# EAGLE design VEML6040 (EAGLE 7.4.0)
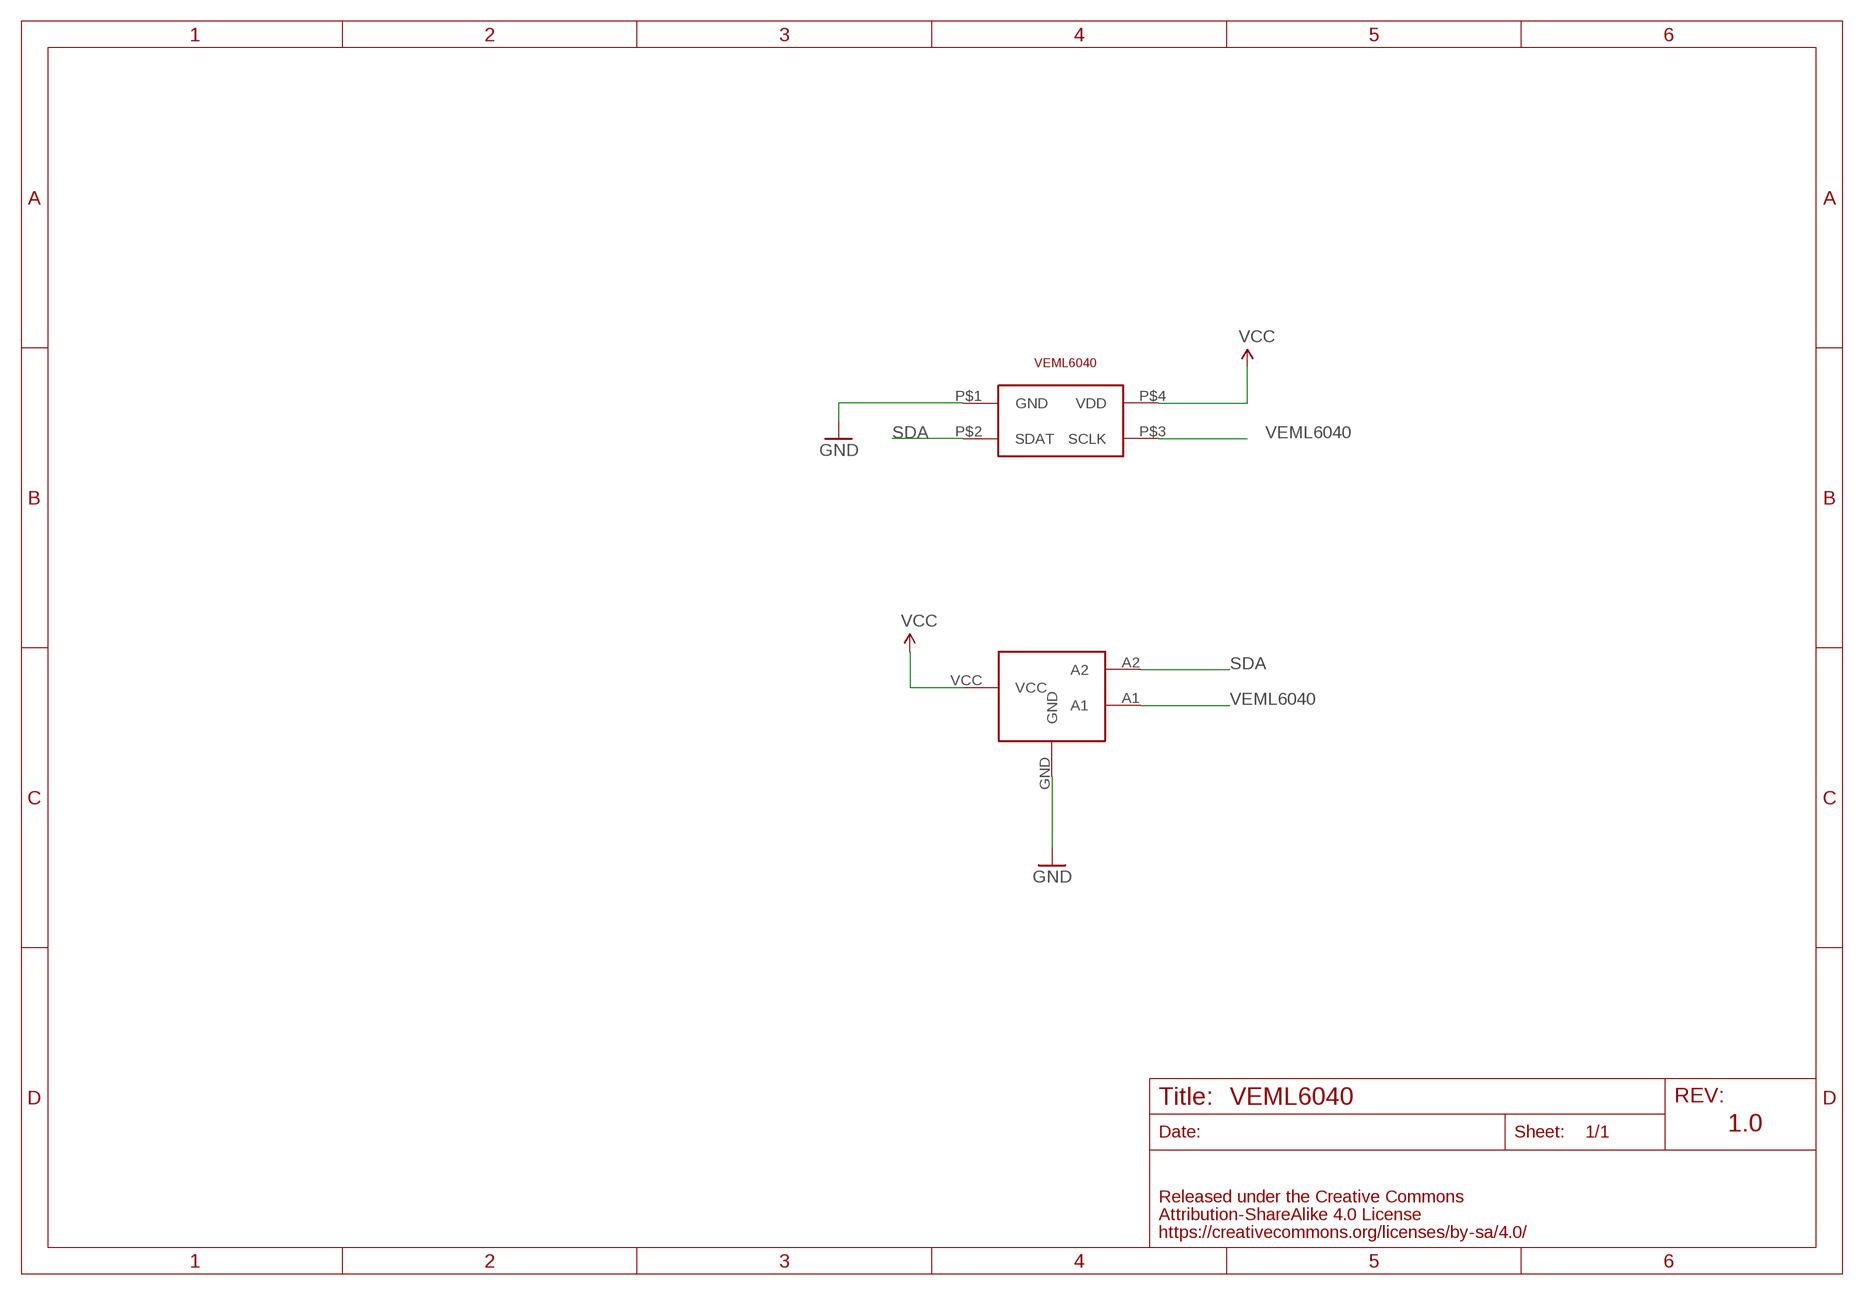
[diagram p0: schematic, sheet 1]

## Parts
6040  VI-VEML6040  [VISHAY-VEML6040]
U$5  4PIN  [4PIN]

## Nets
GND: 6040.P$1(GND) U$5.GND
SDA: 6040.P$2(SDAT) U$5.A2
VCC: 6040.P$4(VDD) U$5.VCC
VEML6040: 6040.P$3(SCLK) U$5.A1

## Notes on the sheet
- 1.0

## Library data of the parts
6040 = FaBo-Mems:VI-VEML6040
U$5 = FaBo-Breakout:4PIN

## Board
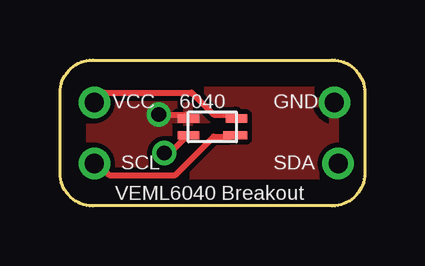
[diagram p1: board, top side]
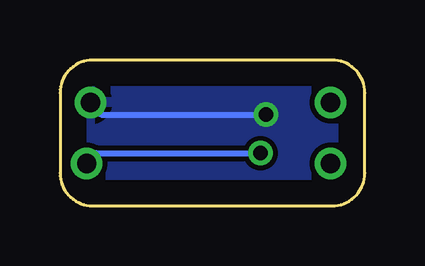
[diagram p2: board, bottom side, seen from below]

Size 12.7 x 6.08 mm. Coordinates in mm from the lower left corner, seen from the top.
Copper layers (1*16): Top 0.035mm / dielectric 1.5mm / Bottom 0.035mm
Design rules "default": minimum track width 10mil, minimum drill 24mil, track to track 8mil, track to pad 8mil, pad to pad 8mil, via to via 8mil, smd to smd 8mil, copper to edge 40mil, drill to drill 8mil, minimum pad ring 10mil, minimum via ring 8mil, stop-mask expansion 4mil, vias tented up to drill 0mil, thermal gap 10mil

### Footprints (pad centres in the part's own frame; a part is rotated, then mirrored left to right if it is on the bottom)
VISHAY-VEML6040 = smd 0.9 x 0.35: P$1 -1,0.35; P$2 -1,-0.35; P$4 1,0.35 | smd 1 x 0.35: P$3 0.95,-0.35
4PIN = drill 0.8: A1 -4.92,-1.27; A2 5.24,-1.27; GND 5.08,1.27; VCC -4.92,1.27

### Placement (x,y rotation side)
6040  6.35,3.29 0 top
U$5  6.35,3.04 0 top

### Tracks (layer width: path | path; a pad name or v marks a point on that pad's centre or on a via)
GND  (via drill 0.61)
  Top 0.254: v4.12,3.8 5.26,3.8 6040.P$1
  Bottom 0.254: v4.12,3.8 10.97,3.8 11.43,4.26 U$5.GND
  pour Top: -0.25,-0.77 12.95,-0.77 12.95,6.34 -0.25,6.34
  pour Bottom: 0,-0.77 12.95,-0.77 12.95,6.34 0,6.34
SDA  (via drill 0.61)
  Top 0.254: v4.34,2.2 4.57,2.2 5.26,2.89 6040.P$2
  Bottom 0.254: v4.34,2.2 11.2,2.2 11.43,1.97 U$5.A2
VCC
  Top 0.254: 6040.P$4 7.32,3.8 6.4,3.8 5.49,4.72 1.83,4.72 1.6,4.49 U$5.VCC
VEML6040
  Top 0.254: 6040.P$3 7.09,2.89 6.4,2.89 4.8,1.29 2.06,1.29 1.6,1.75 U$5.A1

### Text on the board
tPlace: SCL | SDA | VEML6040 Breakout